# EAGLE schematic Scheda_motori_L298 (EAGLE 6.5.0)
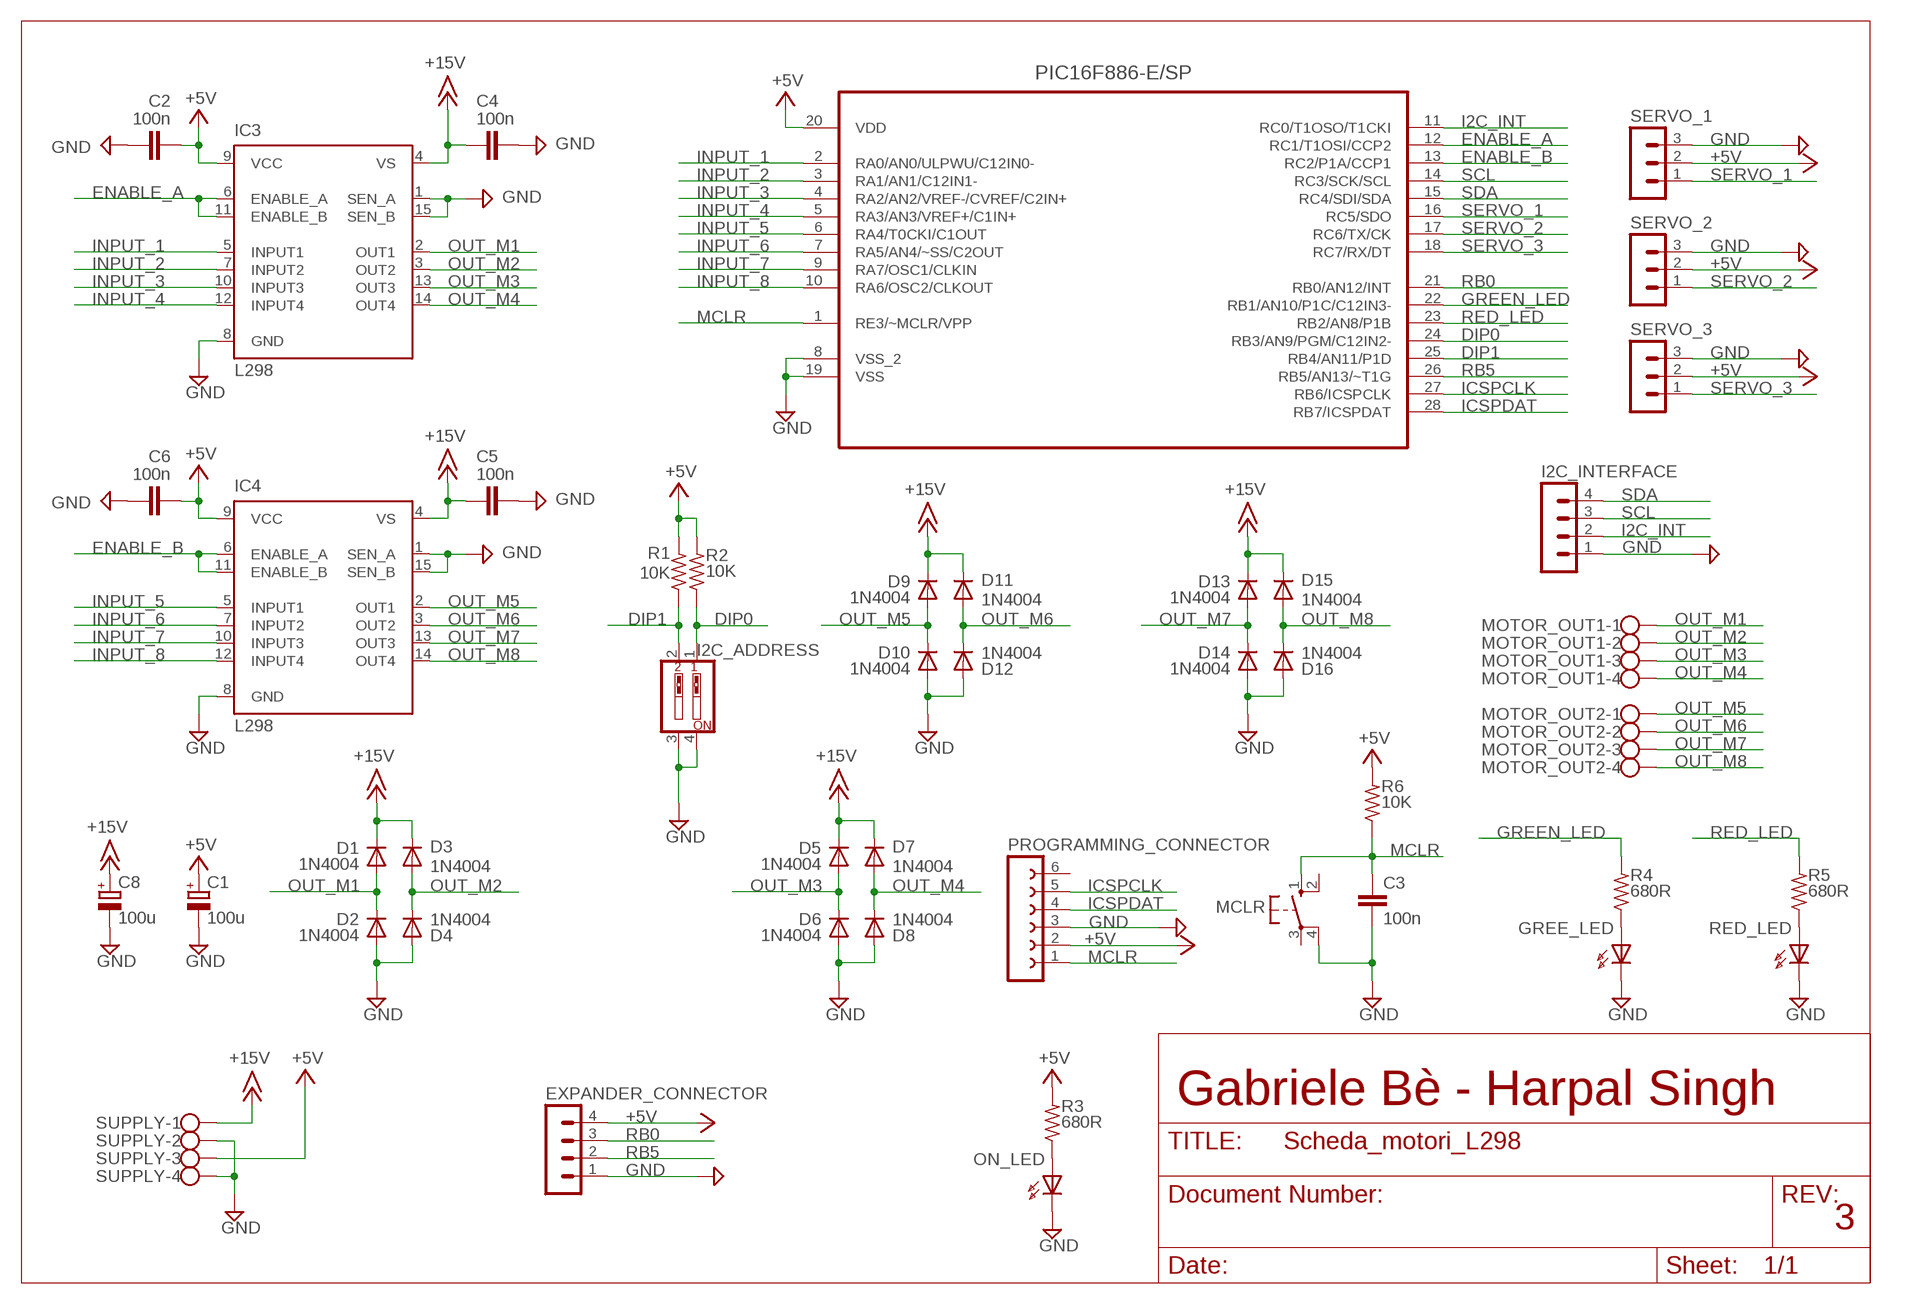
[diagram p0: schematic, sheet 1]

## Parts
C1  100u  CPOL-EUE2.5-7  [E2,5-7]
C2  100n  C-EU050-024X044  [C050-024X044]
C3  100n  C-EU050-024X044  [C050-024X044]
C4  100n  C-EU050-024X044  [C050-024X044]
C5  100n  C-EU050-024X044  [C050-024X044]
C6  100n  C-EU050-024X044  [C050-024X044]
C8  100u  CPOL-EUE2.5-7  [E2,5-7]
D1  1N4004  [DO41-10]
D2  1N4004  [DO41-10]
D3  1N4004  [DO41-10]
D4  1N4004  [DO41-10]
D5  1N4004  [DO41-10]
D6  1N4004  [DO41-10]
D7  1N4004  [DO41-10]
D8  1N4004  [DO41-10]
D9  1N4004  [DO41-10]
D10  1N4004  [DO41-10]
D11  1N4004  [DO41-10]
D12  1N4004  [DO41-10]
D13  1N4004  [DO41-10]
D14  1N4004  [DO41-10]
D15  1N4004  [DO41-10]
D16  1N4004  [DO41-10]
EXPANDER_CONNECTOR  MA04-1  [MA04-1]
GREE_LED  HLMP6  [HLMP6]
I2C_ADDRESS  SW_DIP-2  [EDG-02]
I2C_INTERFACE  MA04-1  [MA04-1]
IC3  L298  [MULTIWATT-15]
IC4  L298  [MULTIWATT-15]
MCLR  10-XX  [B3F-10XX]
MOTOR_OUT1  W237-4  [W237-4]
MOTOR_OUT2  W237-4  [W237-4]
ON_LED  HLMP6  [HLMP6]
PROGRAMMING_CONNECTOR  FE06-1  [FE06]
R1  10K  R-US_0207/10  [0207/10]
R2  10K  R-US_0207/10  [0207/10]
R3  680R  R-US_0207/10  [0207/10]
R4  680R  R-US_0207/10  [0207/10]
R5  680R  R-US_0207/10  [0207/10]
R6  10K  R-US_0207/10  [0207/10]
RED_LED  HLMP6  [HLMP6]
SERVO_1  MA03-1  [MA03-1]
SERVO_2  MA03-1  [MA03-1]
SERVO_3  MA03-1  [MA03-1]
SUPPLY  W237-4  [W237-4]
U$1  PIC16F886-E/SP  [DIP254P762X508-28]

## Nets
+5V: C1.+ C2.2 C6.2 EXPANDER_CONNECTOR.4 IC3.9(VCC) IC4.9(VCC) PROGRAMMING_CONNECTOR.2 R1.2 R2.2 R3.2 R6.2 SERVO_1.2 SERVO_2.2 SERVO_3.2 SUPPLY.3 U$1.20(VDD)
+15V: C4.1 C5.1 C8.+ D1.C D3.C D5.C D7.C D9.C D11.C D13.C D15.C IC3.4(VS) IC4.4(VS) SUPPLY.1
DIP0: I2C_ADDRESS.1 R2.1 U$1.24(RB3/AN9/PGM/C12IN2-)
DIP1: I2C_ADDRESS.2 R1.1 U$1.25(RB4/AN11/P1D)
ENABLE_A: IC3.6(ENABLE_A) IC3.11(ENABLE_B) U$1.12(RC1/T1OSI/CCP2)
ENABLE_B: IC4.6(ENABLE_A) IC4.11(ENABLE_B) U$1.13(RC2/P1A/CCP1)
GND: C1.- C2.1 C3.2 C4.2 C5.2 C6.1 C8.- D2.A D4.A D6.A D8.A D10.A D12.A D14.A D16.A EXPANDER_CONNECTOR.1 GREE_LED.K I2C_ADDRESS.3 I2C_ADDRESS.4 I2C_INTERFACE.1 IC3.1(SEN_A) IC3.8(GND) IC3.15(SEN_B) IC4.1(SEN_A) IC4.8(GND) IC4.15(SEN_B) MCLR.4(P1) ON_LED.K PROGRAMMING_CONNECTOR.3 RED_LED.K SERVO_1.3 SERVO_2.3 SERVO_3.3 SUPPLY.2 SUPPLY.4 U$1.8(VSS_2) U$1.19(VSS)
GREEN_LED: R4.2 U$1.22(RB1/AN10/P1C/C12IN3-)
I2C_INT: I2C_INTERFACE.2 U$1.11(RC0/T1OSO/T1CKI)
ICSPCLK: PROGRAMMING_CONNECTOR.5 U$1.27(RB6/ICSPCLK)
ICSPDAT: PROGRAMMING_CONNECTOR.4 U$1.28(RB7/ICSPDAT)
INPUT_1: IC3.5(INPUT1) U$1.2(RA0/AN0/ULPWU/C12IN0-)
INPUT_2: IC3.7(INPUT2) U$1.3(RA1/AN1/C12IN1-)
INPUT_3: IC3.10(INPUT3) U$1.4(RA2/AN2/VREF-/CVREF/C2IN+)
INPUT_4: IC3.12(INPUT4) U$1.5(RA3/AN3/VREF+/C1IN+)
INPUT_5: IC4.5(INPUT1) U$1.6(RA4/T0CKI/C1OUT)
INPUT_6: IC4.7(INPUT2) U$1.7(RA5/AN4/~SS/C2OUT)
INPUT_7: IC4.10(INPUT3) U$1.9(RA7/OSC1/CLKIN)
INPUT_8: IC4.12(INPUT4) U$1.10(RA6/OSC2/CLKOUT)
MCLR: C3.1 MCLR.1(S) PROGRAMMING_CONNECTOR.1 R6.1 U$1.1(RE3/~MCLR/VPP)
N$3: ON_LED.A R3.1
N$4: GREE_LED.A R4.1
N$5: R5.1 RED_LED.A
OUT_M1: D1.A D2.C IC3.2(OUT1) MOTOR_OUT1.1
OUT_M2: D3.A D4.C IC3.3(OUT2) MOTOR_OUT1.2
OUT_M3: D5.A D6.C IC3.13(OUT3) MOTOR_OUT1.3
OUT_M4: D7.A D8.C IC3.14(OUT4) MOTOR_OUT1.4
OUT_M5: D9.A D10.C IC4.2(OUT1) MOTOR_OUT2.1
OUT_M6: D11.A D12.C IC4.3(OUT2) MOTOR_OUT2.2
OUT_M7: D13.A D14.C IC4.13(OUT3) MOTOR_OUT2.3
OUT_M8: D15.A D16.C IC4.14(OUT4) MOTOR_OUT2.4
RB0: EXPANDER_CONNECTOR.3 U$1.21(RB0/AN12/INT)
RB5: EXPANDER_CONNECTOR.2 U$1.26(RB5/AN13/~T1G)
RED_LED: R5.2 U$1.23(RB2/AN8/P1B)
SCL: I2C_INTERFACE.3 U$1.14(RC3/SCK/SCL)
SDA: I2C_INTERFACE.4 U$1.15(RC4/SDI/SDA)
SERVO_1: SERVO_1.1 U$1.16(RC5/SDO)
SERVO_2: SERVO_2.1 U$1.17(RC6/TX/CK)
SERVO_3: SERVO_3.1 U$1.18(RC7/RX/DT)
Unconnected: MCLR.2(S1) MCLR.3(P) PROGRAMMING_CONNECTOR.6

## Notes on the sheet
- Gabriele Bè - Harpal Singh
- 3

## Library data of the parts
C1 C8 = ITIS:CPOL-EU: POLARIZED CAPACITOR, European symbol
C2-C6 = rcl:C-EU: CAPACITOR, European symbol
D1-D16 = ITIS:1N4004: DIODE general purpose rectifier, 1 A
EXPANDER_CONNECTOR I2C_INTERFACE = con-lstb:MA04-1: PIN HEADER; OC_FARNELL: unknown; OC_NEWARK: unknown
GREE_LED ON_LED RED_LED = display-hp:HLMP6: LED 2mm horizontal; MF: AGILENT TECHNOLOGIES; MPN: HLMP-6500; OC_FARNELL: 1652490; OC_NEWARK: 40K0088
I2C_ADDRESS = special:SW_DIP-2: DIP SWITCH
IC3 IC4 = st-microelectronics:L298: DUAL FULL-BRIDGE DRIVER
MCLR = ITIS:10-XX: OMRON SWITCH
MOTOR_OUT1 MOTOR_OUT2 SUPPLY = con-wago-500:W237-4: WAGO SCREW CLAMP; OC_FARNELL: unknown; OC_NEWARK: unknown
PROGRAMMING_CONNECTOR = con-lsta:FE06-1: FEMALE HEADER; OC_FARNELL: unknown; OC_NEWARK: unknown
R1-R6 = resistor:R-US_: RESISTOR, American symbol
SERVO_1-SERVO_3 = con-lstb:MA03-1: PIN HEADER; OC_FARNELL: unknown; OC_NEWARK: unknown
U$1 = Microchip_By_element14_Batch_1:PIC16F886-E/SP: 8-Bit CMOS Microcontrollers; MPN: PIC16F886-E/SP; OC_FARNELL: 1579590; OC_NEWARK: 74K8573; PACKAGE: DIP-28; SUPPLIER: Microchip